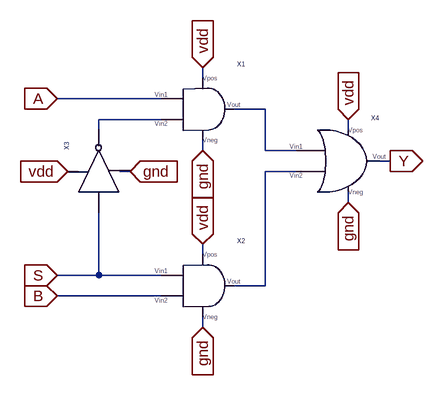
[diagram p0: schematic 2-1mux.asc]
2-1mux.asc, the LTspice schematic file:
Version 4
SHEET 1 880 680
WIRE 224 0 224 -16
WIRE 160 32 0 32
WIRE 320 48 272 48
WIRE 160 64 64 64
WIRE 64 80 64 64
WIRE 448 80 448 64
WIRE 224 112 224 96
WIRE 320 112 320 48
WIRE 368 112 320 112
WIRE 512 128 496 128
WIRE 32 144 16 144
WIRE 112 144 96 144
WIRE 368 144 320 144
WIRE 448 192 448 176
WIRE 224 272 224 256
WIRE 64 304 64 208
WIRE 64 304 0 304
WIRE 160 304 64 304
WIRE 320 320 320 144
WIRE 320 320 272 320
WIRE 160 336 0 336
WIRE 224 384 224 368
FLAG 16 144 vdd
IOPIN 16 144 In
FLAG 224 -16 vdd
IOPIN 224 -16 In
FLAG 224 256 vdd
IOPIN 224 256 In
FLAG 448 64 vdd
IOPIN 448 64 In
FLAG 0 32 A
IOPIN 0 32 In
FLAG 0 336 B
IOPIN 0 336 In
FLAG 0 304 S
IOPIN 0 304 In
FLAG 512 128 Y
IOPIN 512 128 Out
FLAG 224 112 gnd
IOPIN 224 112 In
FLAG 448 192 gnd
IOPIN 448 192 In
FLAG 224 384 gnd
IOPIN 224 384 In
FLAG 112 144 gnd
IOPIN 112 144 In
SYMBOL and 256 48 R0
SYMATTR InstName X1
SYMBOL and 256 320 R0
SYMATTR InstName X2
SYMBOL inverter 80 144 R270
SYMATTR InstName X3
SYMBOL or 192 128 R0
SYMATTR InstName X4

The netlist it stands for:
* 2-1mux.asc
XX1 vdd A N002 gnd N001 and  ; pins vdd A B gnd Y
XX2 vdd S B gnd N003 and  ; pins vdd A B gnd Y
XX3 N002 vdd S gnd inverter  ; pins Y vdd A gnd
XX4 vdd N001 N003 gnd Y or  ; pins vdd A B gnd Y
.backanno
.end